# Altium schematic sheet GanBuck.SchDoc
size A2
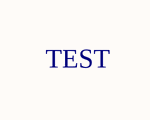
[diagram p0: GanBuck.SchDoc]

## Notes on the sheet
- TEST